# Altium schematic sheet power.SchDoc
size A4
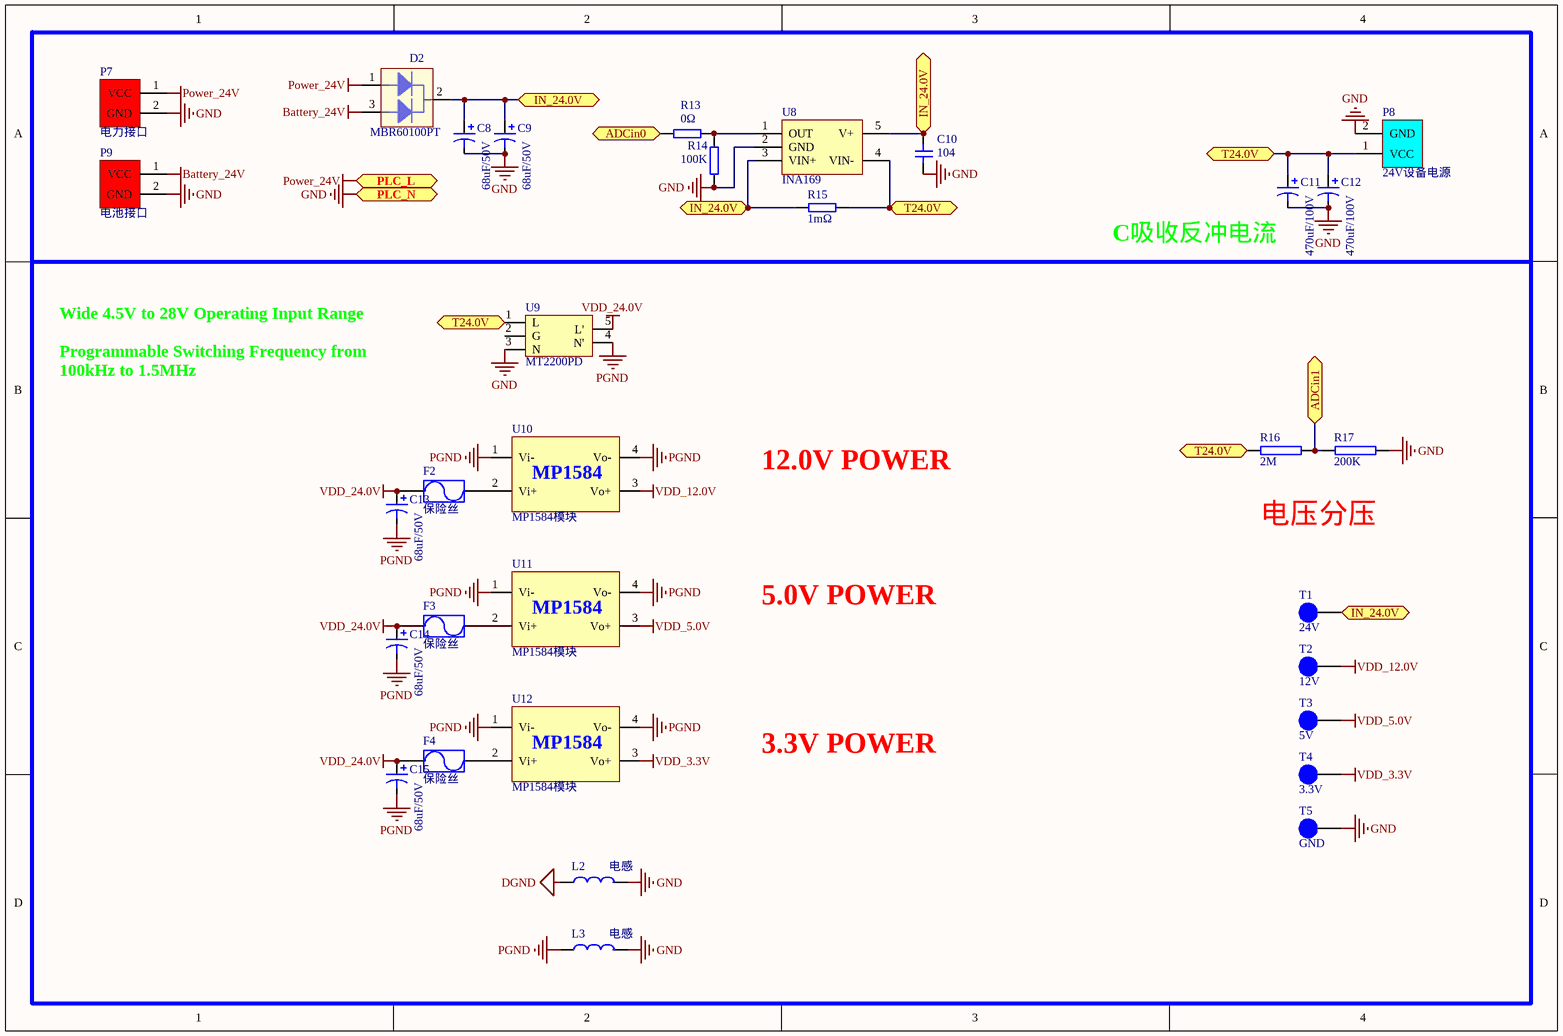
[diagram p0: power.SchDoc]

## Parts
C8  68uF/50V  [RB.2.4]
C9  68uF/50V  [RB.2.4]
C10  104  [0805C]
C11  470uF/100V  [RB.1.2]
C12  470uF/100V  [RB.1.2]
C13  68uF/50V  [RB.1.2]
C14  68uF/50V  [RB.1.2]
C15  68uF/50V  [RB.1.2]
D2  MBR60100PT  [TO-247LS]
F2  保险丝  [FUSE-1812]
F3  保险丝  [FUSE-1812]
F4  保险丝  [FUSE-1812]
L2  电感  [1206L]
L3  电感  [1206L]
P7  电力接口  [XT60-F]
P8  24V设备电源  [XT60-F]
P9  电池接口  [XT60-F]
R13  0Ω  [0805R]
R14  100K  [0805R]
R15  1mΩ  [2512R]
R16  2M  [0805R]
R17  200K  [0805R]
T1  24V  [HEADER 1]
T2  12V  [HEADER 1]
T3  5V  [HEADER 1]
T4  3.3V  [HEADER 1]
T5  GND  [HEADER 1]
U8  INA169  [SOT23-5]
U9  MT2200PD  [MT2200PD-6A]
U10  MP1584模块  [MP1584电源模块]
U11  MP1584模块  [MP1584电源模块]
U12  MP1584模块  [MP1584电源模块]

## Ports
ADCin0, ADCin1, IN_24.0V, PLC_L, PLC_N, T24.0V

## Nets
Battery_24V: D2.3 P9.1(VCC)
DGND: L2.1
GND: C8.2 C9.2 C10.1 C11.2 C12.2 L2.2 L3.2 P7.2(GND) P8.2(GND) P9.2(GND) R14.2 R17.2 T5.1 U8.2(GND) U9.3(N) ; port PLC_N
PGND: C13.2 C14.2 C15.2 L3.1 U9.4(N') U10.1(Vi-) U10.4(Vo-) U11.1(Vi-) U11.4(Vo-) U12.1(Vi-) U12.4(Vo-)
Power_24V: D2.1 P7.1(VCC) ; port PLC_L
VDD_3.3V: T4.1 U12.3(Vo+)
VDD_5.0V: T3.1 U11.3(Vo+)
VDD_12.0V: T2.1 U10.3(Vo+)
VDD_24.0V: C13.1 C14.1 C15.1 F2.1 F3.1 F4.1 U9.5(L')
ADCin0: R13.1 ; port ADCin0
ADCin1: R16.2 R17.1 ; port ADCin1
IN_24.0V: C8.1 C9.1 C10.2 D2.2 R15.2 T1.1 U8.3(VIN+) U8.5(V+) ; port IN_24.0V
T24.0V: C11.1 C12.1 P8.1(VCC) R15.1 R16.1 U8.4(VIN-) U9.1(L) ; port T24.0V
NetF2_2: F2.2 U10.2(Vi+)
NetF3_2: F3.2 U11.2(Vi+)
NetF4_2: F4.2 U12.2(Vi+)
NetR13_2: R13.2 R14.1 U8.1(OUT)

Not connected (* = marked no-connect by the designer): U9 2(G)

## Notes on the sheet
- C吸收反冲电流
- Wide 4.5V to 28V Operating Input Range
  Programmable Switching Frequency from
  100kHz to 1.5MHz
- 12.0V POWER
- 电压分压
- 5.0V POWER
- 3.3V POWER
- (in symbol MP1584电源模块) MP1584

## Library data of the parts
C8 C9 C11-C15 = Cap3: 直插极性电容
C10 = Cap1: 无极贴片电容
F2-F4 = Fuse
L2 L3 = L
P7 P9 = 电源端子
P8 = 推进器电源
R13-R15 = Res: 电阻
R16 R17 = R1
T1-T5 = 测试点
U10-U12 = MP1584电源模块